# EAGLE design max86141-breakout (EAGLE 9.6.2)
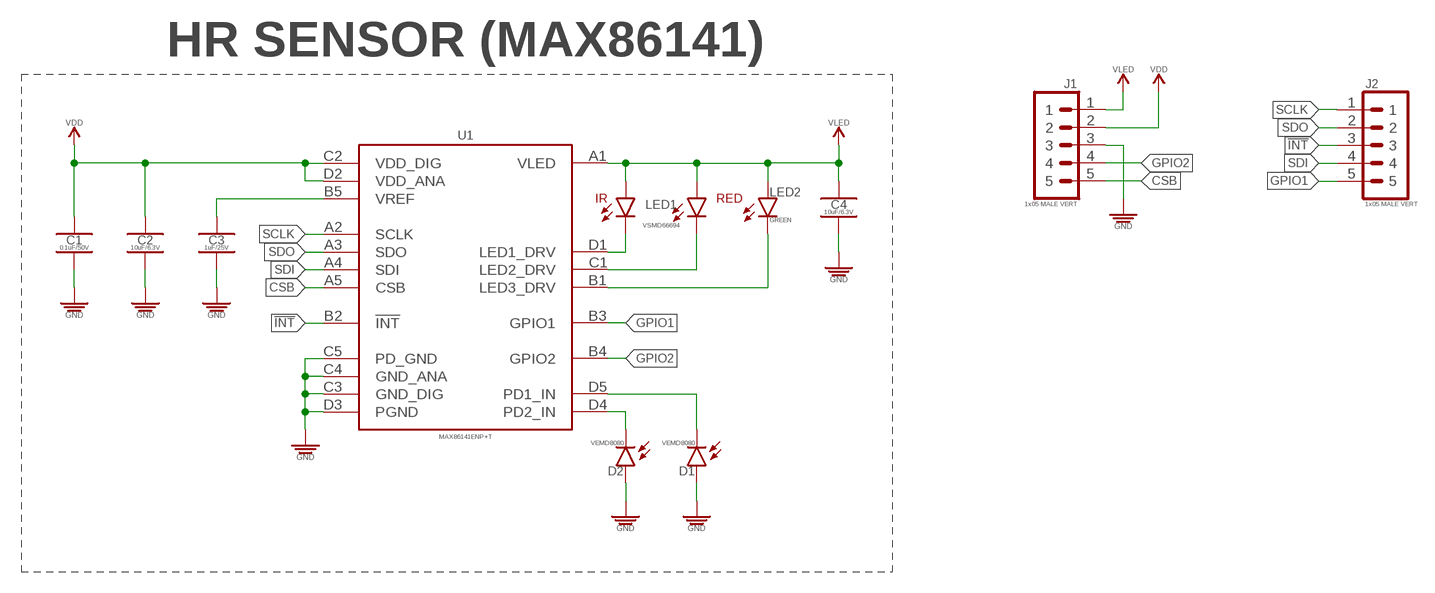
[diagram p0: schematic, sheet 1]

## Parts
C1  0.1uF/50V  0.1UF_SMD-0402_50V-10%  [CAPC1005X55_SMD-0402]
C2  10uF/6.3V  10UF_CER_SMD-0402_6.3V-20%  [CAPC1005X55_SMD-0402]
C3  1uF/25V  1UF_CER_SMD-0402_25V-10%  [CAPC1005X55_SMD-0402]
C4  10uF/6.3V  10UF_CER_SMD-0402_6.3V-20%  [CAPC1005X55_SMD-0402]
D1  VEMD8080  [SON131P250X480X53-8N]
D2  VEMD8080  [SON131P250X480X53-8N]
J1  1x05 MALE VERT  1X05_PTH_VERT_MALE_2.54MM  [HDRV5W64P254_1X5_1270X254X838B]
J2  1x05 MALE VERT  1X05_PTH_VERT_MALE_2.54MM  [HDRV5W64P254_1X5_1270X254X838B]
LED1  VSMD66694  [DIOCAV100P200X200X87-4N]
LED2  GREEN  LED_SMD-0402_DISCRETE_GREEN  [LEDC1005X40_LED-0402]
U1  MAX86141ENP+T  MAX86141  [BGA20C40P5X4_184X204X100N]

## Nets
!INT!: J2.3 U1.B2(!INT!)
CSB: J1.5 U1.A5(CSB)
GND: C1.2 C2.2 C3.2 C4.2 D1.1(A) D1.2(A) D1.3(A) D1.4(A) D1.5(A) D1.6(A) D1.7(A) D2.1(A) D2.2(A) D2.3(A) D2.4(A) D2.5(A) D2.6(A) D2.7(A) J1.3 U1.C3(GND_DIG) U1.C4(GND_ANA) U1.C5(PD_GND) U1.D3(PGND)
GPIO1: J2.5 U1.B3(GPIO1)
GPIO2: J1.4 U1.B4(GPIO2)
N$1: D2.8(K) U1.D4(PD2_IN)
N$2: D1.8(K) U1.D5(PD1_IN)
N$3: LED1.1(K-IR) U1.D1(LED1_DRV)
N$4: LED1.3(K-RED) U1.C1(LED2_DRV)
N$5: LED2.K U1.B1(LED3_DRV)
N$6: C3.1 U1.B5(VREF)
SCLK: J2.1 U1.A2(SCLK)
SDI: J2.4 U1.A4(SDI)
SDO: J2.2 U1.A3(SDO)
VDD: C1.1 C2.1 J1.2 U1.C2(VDD_DIG) U1.D2(VDD_ANA)
VLED: C4.1 J1.1 LED1.2(A-RED) LED1.4(A-IR) LED2.A U1.A1(VLED)

## Notes on the sheet
- HR SENSOR (MAX86141)

## Library data of the parts
C1 = _capacitors:0.1UF; DATASHEET: https://product.tdk.com/info/en/catalog/datasheets/mlcc_commercial_soft_en.pdf; DIST: Digikey; DISTLINK: https://www.digikey.com/products/en?keywords=445-173610-1-ND; DISTPN: 445-173610-1-ND; MFR: TDK Corporation; MPN: C1005X7R1H104K050BE
C2 C4 = _capacitors:10UF; DATASHEET: https://www.murata.com/~/media/webrenewal/support/library/catalog/products/capacitor/mlcc/c02e.ashx; DIST: Digikey; DISTLINK: https://www.digikey.com/products/en?keywords=490-13233-1-ND; DISTPN: 490-13233-1-ND; MFR: Murata Electronics North America; MPN: GRM155C80J106ME11D
C3 = _capacitors:1UF; DATASHEET: https://product.tdk.com/info/en/catalog/datasheets/mlcc_commercial_lowprofile_en.pdf; DIST: Digikey; DISTLINK: https://www.digikey.com/products/en?keywords=445-13185-1-ND; DISTPN: 445-13185-1-ND; MFR: TDK Corporation; MPN: CGB2A1X5R1E105K033BC
D1 D2 = _discrete_semiconductors:VEMD8080: PHOTODIODE 780 TO 1050 NM Photodiode 850nm 70ns 130° 8-SMD, No Lead; DATASHEET: https://www.vishay.com/docs/84565/vemd8080.pdf; DIST: Digikey; DISTLINK: https://www.digikey.com/en/products/detail/vishay-semiconductor-opto-division/VEMD8080/8602378?s=N4IgTCBcDaIGoFECyARAHABkwYQCoFoA5FEAXQF8g; DISTPN: VEMD8080CT-ND; MFR: Vishay Semiconductor Opto Division; MPN: VEMD8080
J1 J2 = _connectors:1X05; DATASHEET: https://s3.amazonaws.com/catalogspreads-pdf/PAGE112-113%20.100%20MALE%20HDR.pdf; DIST: Digikey; DISTLINK: https://www.digikey.com/en/products/detail/sullins-connector-solutions/PEC05SAAN/859158?s=N4IgTCBcDaIMoEYAMCwFEC0SCsGByAIiALoC%2BQA; DISTPN: S1012E-05-ND; MFR: Sullins Connector Solutions; MPN: PEC05SAAN
LED1 = _leds:VSMD66694; DATASHEET: https://www.vishay.com/docs/84324/vsmd66694.pdf; DIST: Digikey; DISTLINK: https://www.digikey.com/en/products/detail/vishay-semiconductor-opto-division/VSMD66694/6051070?s=N4IgTCBcDaIGoGUCyARAbBgnAFgMIBUBaAORRAF0BfIA; DISTPN: VSMD66694CT-ND; MFR: Vishay Semiconductor Opto Division; MPN: VSMD66694
LED2 = _leds:LED; DATASHEET: https://www.bivar.com/portals/0/products/SM0402GC.pdf; DIST: Digikey; DISTLINK: https://www.digikey.com/products/en?keywords=492-2205-1-ND; DISTPN: 492-2205-1-ND; MFR: Bivar Inc.; MPN: SM0402GC
U1 = _sensors:MAX8614; DATASHEET: https://datasheets.maximintegrated.com/en/ds/MAX86140.pdf; DIST: Digikey; DISTLINK: https://www.digikey.com/en/products/detail/maxim-integrated/MAX86141ENP-T/7804058?s=N4IgTCBcDaILIEEAaAOAbARgCwYKIDkAFAagBUBhUgWnwBEQBdAXyA; DISTPN: MAX86141ENP+TCT-ND; MFR: Maxim Integrated; MPN: MAX86141ENP+T

## Board
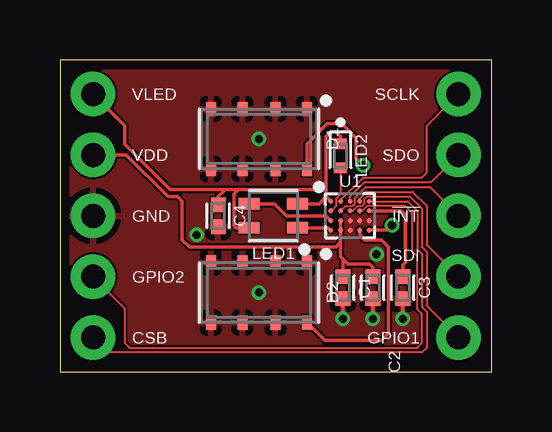
[diagram p1: board, top side]
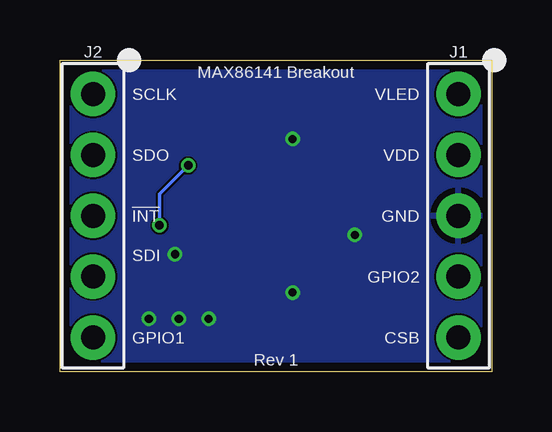
[diagram p2: board, bottom side, seen from below]

Size 18 x 13 mm. Coordinates in mm from the lower left corner, seen from the top.
Outline: 0,0 18,0 18,13 0,13 0,0
Copper layers (1*16): Top 0.035559375mm / dielectric 1.6mm / Bottom 0.035559375mm
Design rules "stella-wearables": minimum track width 3mil, minimum drill 6mil, track to track 3mil, track to pad 2mil, pad to pad 3mil, via to via 3mil, smd to smd 3mil, copper to edge 15mil, drill to drill 6mil, minimum pad ring 5mil, minimum via ring 5mil, stop-mask expansion 2.5mil, vias tented up to drill 0mil, thermal gap 10mil

### Footprints (pad centres in the part's own frame; a part is rotated, then mirrored left to right if it is on the bottom)
CAPC1005X55_SMD-0402 = smd 0.585 x 0.612: 1 -0.458,0; 2 0.458,0
SON131P250X480X53-8N = smd 0.59 x 0.42: 1 -1.255,2; 2 -1.255,0.69; 3 -1.255,-0.69; 4 -1.255,-2; 5 1.255,-2; 6 1.255,-0.69; 7 1.255,0.69; 8 1.255,2
HDRV5W64P254_1X5_1270X254X838B = drill 1 pad 1.85: 1 -5.08,0; 2 -2.54,0; 3 0,0; 4 2.54,0; 5 5.08,0
DIOCAV100P200X200X87-4N = smd 0.88 x 0.49: 1 -1.01,0.5; 2 -1.01,-0.5; 3 1.01,-0.5; 4 1.01,0.5
LEDC1005X40_LED-0402 = smd 0.454 x 0.554: A -0.5,0; K 0.5,0
BGA20C40P5X4_184X204X100N = smd 0.2 x 0.2: A1 -0.8,0.6; A2 -0.4,0.6; A3 0,0.6; A4 0.4,0.6; A5 0.8,0.6; B1 -0.8,0.2; B2 -0.4,0.2; B3 0,0.2; B4 0.4,0.2; B5 0.8,0.2; C1 -0.8,-0.2; C2 -0.4,-0.2; C3 0,-0.2; C4 0.4,-0.2; C5 0.8,-0.2; D1 -0.8,-0.6; D2 -0.4,-0.6; D3 0,-0.6; D4 0.4,-0.6; D5 0.8,-0.6

### Placement (x,y rotation side)
C1  11.8,3.5 270 top
C2  13.05,3.5 270 top
C3  14.3,3.5 270 top
C4  6.6,6.5 270 top
D1  8.3,9.7 270 top
D2  8.3,3.3 270 top
J1  1.38,6.5 270 bottom
J2  16.62,6.5 270 bottom
LED1  8.9,6.5 180 top
LED2  11.7,9 270 top
U1  12.1,6.5 0 top

### Tracks (layer width: path | path; a pad name or v marks a point on that pad's centre or on a via)
!INT!
  Top 0.076: U1.B2 11.9,6.9 12.18,6.9 12.3,7.02 12.3,7.25 12.75,7.7 15.42,7.7 J2.3
CSB
  Top 0.076: U1.A5 14.5,7.1 14.9,6.7 14.9,5.1 15.1,4.9 15.1,2.7 15.3,2.5 15.3,1 15.1,0.8 2,0.8 J1.5
GND  (via drill 0.35, 0.35 pad 0.15)
  Top 0.152: C1.2 v11.8,2.2 | C3.2 v14.3,2.2 | C2.2 v13.05,2.2
  other vias: 5.7,5.7 8.3,9.7 8.3,3.3 13.2,4.9
  pour Bottom (rank 6): 0,0 18,0 18,13 0,13
  pour Top (rank 6): 0,0 18,0 18,13 0,13
GPIO1
  Top 0.076: U1.B3 12.2,6.7 12.4,6.9 12.58,6.9 12.7,7.02 12.7,7.2 12.8,7.3 14.6,7.3 15.1,6.8 15.1,5.2 15.3,5 15.3,2.74 J2.5
GPIO2
  Top 0.076: U1.B4 12.6,6.7 12.8,6.9 14.4,6.9 14.7,6.6 14.7,5 14.9,4.8 14.9,2.6 15.1,2.4 15.1,1.2 14.9,1 2.9,1 2.7,1.2 2.7,2.64 J1.4
N$1
  Top 0.152: D2.8 11.04,1.3 13.4,1.3 13.7,1.6 13.7,5.2 13.4,5.5 12.7,5.5 12.5,5.7 U1.D4
N$2  (via drill 0.35 pad 0.15)
  Top 0.152: v13.85,6.1 13.65,5.9 U1.D5 | v12.65,8.6 12.35,8.9 12.35,9.75 11.75,10.35 11.14,10.35 10.3,9.5 D1.8
  Bottom 0.152: v12.65,8.6 13.85,7.4 v13.85,6.1
N$3
  Top 0.152: LED1.1 11.2,6 U1.D1
N$4
  Top 0.152: U1.C1 11.1,6.5 9.45,6.5 8.95,7 LED1.3
N$5
  Top 0.076: U1.B1 11.5,6.9 11.5,7.2 11.7,7.4 LED2.K
N$6
  Top 0.152: C3.1 14.3,4.46 14.4,4.56 14.4,6.54 14.23,6.7 U1.B5
SCLK
  Top 0.076: U1.A2 11.7,7.15 12.65,8.1 15.1,8.1 15.3,8.3 15.3,10.26 J2.1
SDI
  Top 0.076: U1.A4 12.5,7.22 12.78,7.5 14.7,7.5 15.3,6.9 15.3,5.28 J2.4
SDO
  Top 0.076: U1.A3 12.1,7.3 12.7,7.9 15.48,7.9 J2.2
VDD
  Top 0.152: U1.C2 U1.D2 11.7,5.4 | J1.2 2.76,9.04 4.5,7.3 4.9,7.3 5.1,7.1 5.1,5.5 5.4,5.2 11.5,5.2 11.7,5.4 | C2.1 13.05,4.35 12.9,4.5 12,4.5 11.8,4.7 | C1.1 11.8,4.7 | 11.8,4.7 11.7,4.8 11.7,5.4
VLED
  Top 0.152: LED1.4 7.35,6 7.25,6.1 7.25,7.4 7.45,7.6 | J1.1 2.7,10.26 2.7,9.5 4.6,7.6 6.9,7.6 | U1.A1 11.1,7.3 | 11.1,7.3 11.1,7.9 | 11.1,7.3 10.8,7 LED1.2 | 11.1,7.9 10.8,7.6 7.45,7.6 | 7.45,7.6 6.9,7.6 | C4.1 6.6,7.3 6.9,7.6 | LED2.A 11.7,9.8 11.5,10 11.3,10 11.1,9.8 11.1,7.9

### Text on the board
tPlace: VLED | SCLK | VDD | SDO | GND | !INT! | SDI | GPIO2 | CSB | GPIO1
bPlace: MAX86141 Breakout | VLED | SCLK | VDD | SDO | GND | !INT! | SDI | GPIO2 | CSB | GPIO1 | Rev 1